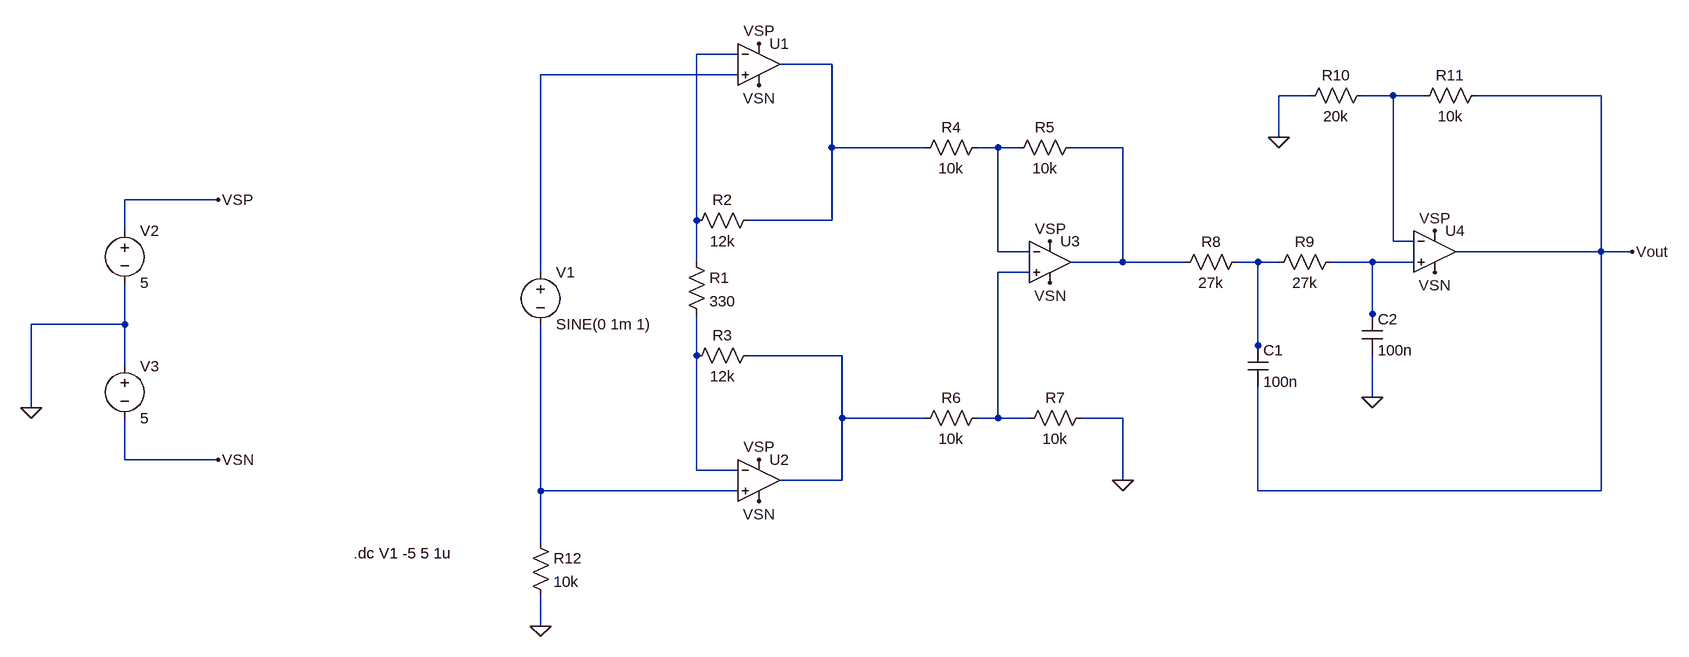
[diagram p0: schematic Exercitiul1.asc]
Exercitiul1.asc, the LTspice schematic file:
Version 4
SHEET 1 2472 696
WIRE 1024 -224 960 -224
WIRE 1168 -208 1088 -208
WIRE 1024 -192 720 -192
WIRE 1904 -160 1856 -160
WIRE 2032 -160 1984 -160
WIRE 2080 -160 2032 -160
WIRE 2352 -160 2160 -160
WIRE 1856 -96 1856 -160
WIRE 1168 -80 1168 -208
WIRE 1312 -80 1168 -80
WIRE 1424 -80 1392 -80
WIRE 1456 -80 1424 -80
WIRE 1616 -80 1536 -80
WIRE 224 0 80 0
WIRE 960 32 960 -224
WIRE 1168 32 1168 -80
WIRE 1168 32 1040 32
WIRE 80 48 80 0
WIRE 2032 64 2032 -160
WIRE 2064 64 2032 64
WIRE 1424 80 1424 -80
WIRE 1472 80 1424 80
WIRE 2352 80 2352 -160
WIRE 2352 80 2128 80
WIRE 2400 80 2352 80
WIRE 960 96 960 32
WIRE 1616 96 1616 -80
WIRE 1616 96 1536 96
WIRE 1712 96 1616 96
WIRE 1824 96 1792 96
WIRE 1856 96 1824 96
WIRE 2000 96 1936 96
WIRE 2064 96 2000 96
WIRE 720 112 720 -192
WIRE 1472 112 1424 112
WIRE 2000 176 2000 96
WIRE 80 192 80 128
WIRE 80 192 -64 192
WIRE 2000 192 2000 176
WIRE 1824 224 1824 96
WIRE 960 240 960 176
WIRE 1184 240 1040 240
WIRE 1824 240 1824 224
WIRE 80 256 80 192
WIRE 2000 304 2000 240
WIRE -64 320 -64 192
WIRE 1184 336 1184 240
WIRE 1312 336 1184 336
WIRE 1424 336 1424 112
WIRE 1424 336 1392 336
WIRE 1472 336 1424 336
WIRE 1616 336 1552 336
WIRE 80 400 80 336
WIRE 224 400 80 400
WIRE 960 416 960 240
WIRE 1024 416 960 416
WIRE 1184 432 1184 336
WIRE 1184 432 1088 432
WIRE 1616 432 1616 336
WIRE 720 448 720 192
WIRE 1024 448 720 448
WIRE 1824 448 1824 288
WIRE 2352 448 2352 80
WIRE 2352 448 1824 448
WIRE 720 528 720 448
WIRE 720 656 720 608
FLAG -64 320 0
FLAG 224 0 VSP
FLAG 224 400 VSN
FLAG 720 656 0
FLAG 1056 -176 VSN
FLAG 1056 -240 VSP
FLAG 1056 464 VSN
FLAG 1056 400 VSP
FLAG 1616 432 0
FLAG 1504 128 VSN
FLAG 1504 64 VSP
FLAG 2000 304 0
FLAG 1856 -96 0
FLAG 2400 80 Vout
FLAG 2096 48 VSP
FLAG 2096 112 VSN
SYMBOL voltage 80 32 R0
WINDOW 123 0 0 Left 0
WINDOW 39 0 0 Left 0
SYMATTR InstName V2
SYMATTR Value 5
SYMBOL voltage 80 240 R0
WINDOW 123 0 0 Left 0
WINDOW 39 0 0 Left 0
SYMATTR InstName V3
SYMATTR Value 5
SYMBOL voltage 720 96 R0
WINDOW 123 24 124 Left 2
WINDOW 39 0 0 Left 0
SYMATTR InstName V1
SYMATTR Value SINE(0 1m 1)
SYMBOL res 704 512 R0
SYMATTR InstName R12
SYMATTR Value 10k
SYMBOL OpAmps\\UniversalOpamp2 1056 -208 R0
SYMATTR InstName U1
SYMBOL OpAmps\\UniversalOpamp2 1056 432 R0
SYMATTR InstName U2
SYMBOL res 944 80 R0
SYMATTR InstName R1
SYMATTR Value 330
SYMBOL res 1056 16 R90
WINDOW 0 0 56 VBottom 2
WINDOW 3 32 56 VTop 2
SYMATTR InstName R2
SYMATTR Value 12k
SYMBOL res 1056 224 R90
WINDOW 0 0 56 VBottom 2
WINDOW 3 32 56 VTop 2
SYMATTR InstName R3
SYMATTR Value 12k
SYMBOL res 1408 -96 R90
WINDOW 0 0 56 VBottom 2
WINDOW 3 32 56 VTop 2
SYMATTR InstName R4
SYMATTR Value 10k
SYMBOL res 1552 -96 R90
WINDOW 0 0 56 VBottom 2
WINDOW 3 32 56 VTop 2
SYMATTR InstName R5
SYMATTR Value 10k
SYMBOL OpAmps\\UniversalOpamp2 1504 96 R0
SYMATTR InstName U3
SYMBOL res 1408 320 R90
WINDOW 0 0 56 VBottom 2
WINDOW 3 32 56 VTop 2
SYMATTR InstName R6
SYMATTR Value 10k
SYMBOL res 1568 320 R90
WINDOW 0 0 56 VBottom 2
WINDOW 3 32 56 VTop 2
SYMATTR InstName R7
SYMATTR Value 10k
SYMBOL res 1808 80 R90
WINDOW 0 0 56 VBottom 2
WINDOW 3 32 56 VTop 2
SYMATTR InstName R8
SYMATTR Value 27k
SYMBOL res 1952 80 R90
WINDOW 0 0 56 VBottom 2
WINDOW 3 32 56 VTop 2
SYMATTR InstName R9
SYMATTR Value 27k
SYMBOL cap 1808 224 R0
SYMATTR InstName C1
SYMATTR Value 100n
SYMBOL cap 1984 176 R0
SYMATTR InstName C2
SYMATTR Value 100n
SYMBOL OpAmps\\UniversalOpamp2 2096 80 R0
SYMATTR InstName U4
SYMBOL res 2000 -176 R90
WINDOW 0 0 56 VBottom 2
WINDOW 3 32 56 VTop 2
SYMATTR InstName R10
SYMATTR Value 20k
SYMBOL res 2176 -176 R90
WINDOW 0 0 56 VBottom 2
WINDOW 3 32 56 VTop 2
SYMATTR InstName R11
SYMATTR Value 10k
TEXT 432 544 Left 2 !.dc V1 -5 5 1u

The netlist it stands for:
* Exercitiul1.asc
V2 VSP 0 5
V3 0 VSN 5
V1 N003 N012 SINE(0 1m 1)
R12 N012 0 10k
XU1 N003 N001 VSP VSN N002 level.2 Avol=1Meg GBW=10Meg Slew=10Meg ilimit=25m rail=0 Vos=0 phimargin=45 en=0 enk=0 in=0 ink=0 Rin=500Meg  ; pins IN+ IN- V+ V- OUT
XU2 N012 N010 VSP VSN N011 level.2 Avol=1Meg GBW=10Meg Slew=10Meg ilimit=25m rail=0 Vos=0 phimargin=45 en=0 enk=0 in=0 ink=0 Rin=500Meg  ; pins IN+ IN- V+ V- OUT
R1 N001 N010 330
R2 N002 N001 12k
R3 N011 N010 12k
R4 N005 N002 10k
R5 N006 N005 10k
XU3 N009 N005 VSP VSN N006 level.2 Avol=1Meg GBW=10Meg Slew=10Meg ilimit=25m rail=0 Vos=0 phimargin=45 en=0 enk=0 in=0 ink=0 Rin=500Meg  ; pins IN+ IN- V+ V- OUT
R6 N009 N011 10k
R7 0 N009 10k
R8 N007 N006 27k
R9 N008 N007 27k
C1 N007 Vout 100n
C2 N008 0 100n
XU4 N008 N004 VSP VSN Vout level.2 Avol=1Meg GBW=10Meg Slew=10Meg ilimit=25m rail=0 Vos=0 phimargin=45 en=0 enk=0 in=0 ink=0 Rin=500Meg  ; pins IN+ IN- V+ V- OUT
R10 N004 0 20k
R11 Vout N004 10k
.dc V1 -5 5 1u
.lib UniversalOpamps2.sub
.backanno
.end